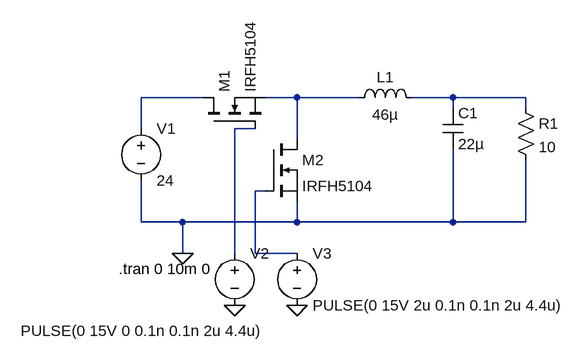
[diagram p0: schematic Synchronous_Buck_24V-5V.asc]
Synchronous_Buck_24V-5V.asc, the LTspice schematic file:
Version 4
SHEET 1 880 680
WIRE 64 144 -32 144
WIRE 208 144 160 144
WIRE 304 144 208 144
WIRE 448 144 384 144
WIRE 560 144 448 144
WIRE 448 160 448 144
WIRE 560 160 560 144
WIRE -32 192 -32 144
WIRE 144 192 112 192
WIRE 208 208 208 144
WIRE 160 288 144 288
WIRE -32 336 -32 272
WIRE 32 336 -32 336
WIRE 208 336 208 304
WIRE 208 336 32 336
WIRE 448 336 448 224
WIRE 448 336 208 336
WIRE 560 336 560 240
WIRE 560 336 448 336
WIRE 32 384 32 336
WIRE 112 384 112 192
WIRE 144 384 144 288
WIRE 208 384 144 384
FLAG 32 384 0
FLAG 112 464 0
FLAG 208 464 0
SYMBOL ind 288 160 R270
WINDOW 0 32 56 VTop 2
WINDOW 3 5 56 VBottom 2
SYMATTR InstName L1
SYMATTR Value 46µ
SYMBOL voltage -32 176 R0
WINDOW 123 0 0 Left 0
WINDOW 39 0 0 Left 0
SYMATTR InstName V1
SYMATTR Value 24
SYMBOL nmos 64 192 R270
SYMATTR InstName M1
SYMATTR Value IRFH5104
SYMBOL nmos 160 208 R0
SYMATTR InstName M2
SYMATTR Value IRFH5104
SYMBOL cap 432 160 R0
SYMATTR InstName C1
SYMATTR Value 22µ
SYMBOL res 544 144 R0
SYMATTR InstName R1
SYMATTR Value 10
SYMBOL voltage 112 368 R0
WINDOW 3 -329 135 Left 2
WINDOW 123 0 0 Left 0
WINDOW 39 0 0 Left 0
SYMATTR InstName V2
SYMATTR Value PULSE(0 15V 0 0.1n 0.1n 2u 4.4u)
SYMBOL voltage 208 368 R0
WINDOW 123 0 0 Left 0
WINDOW 39 0 0 Left 0
SYMATTR InstName V3
SYMATTR Value PULSE(0 15V 2u 0.1n 0.1n 2u 4.4u)
TEXT -66 408 Left 2 !.tran 0 10m 0

The netlist it stands for:
* Synchronous_Buck_24V-5V.asc
L1 N002 N003 46µ
V1 N001 0 24
M1 N001 N004 N002 N002 IRFH5104
M2 N002 N005 0 0 IRFH5104
C1 N003 0 22µ
R1 N003 0 10
V2 N004 0 PULSE(0 15V 0 0.1n 0.1n 2u 4.4u)
V3 N005 0 PULSE(0 15V 2u 0.1n 0.1n 2u 4.4u)
.model NMOS NMOS
.model PMOS PMOS
.lib standard.mos
.tran 0 10m 0
.backanno
.end